# Altium project MercurialSDR.PrjPcb
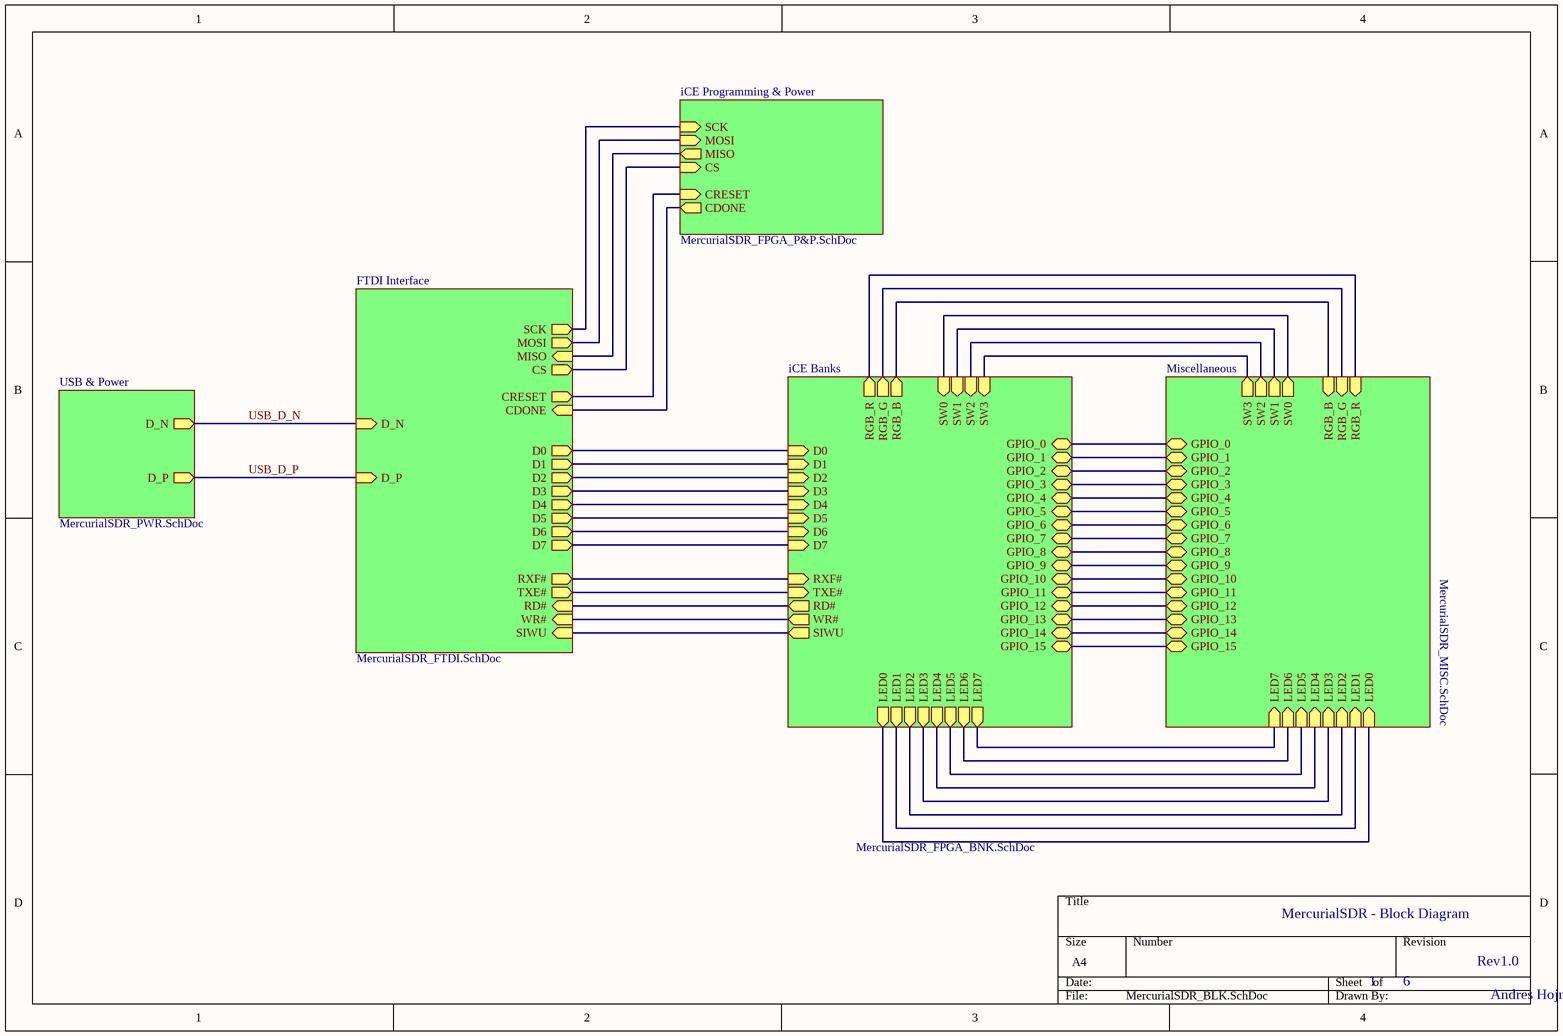
[diagram p0: MercurialSDR_BLK.SchDoc]
6 sheets, 142 parts. Net scope: hierarchical (ports join the sheet entries above them; power ports are global).
Board file: MercurialSDR.PcbDoc
Sheets:
  MercurialSDR_BLK.SchDoc
    Miscellaneous = MercurialSDR_MISC.SchDoc
    iCE Banks = MercurialSDR_FPGA_BNK.SchDoc
    iCE Programming & Power = MercurialSDR_FPGA_P&P.SchDoc
    FTDI Interface = MercurialSDR_FTDI.SchDoc
    USB & Power = MercurialSDR_PWR.SchDoc

## Sheet MercurialSDR_BLK.SchDoc: MercurialSDR - Block Diagram
size A4; Author: Andres Hojnadel; DrawnBy: Andres Hojnadel; Revision: Rev1.0; SheetNumber: 1; SheetTotal: 6; ProjectName: MercurialSDR

### Sub-sheets
FTDI Interface = MercurialSDR_FTDI.SchDoc: SCK (out), MOSI (out), MISO (in), CS (out), CDONE (in), CRESET (out), D0 (out), D1 (out), D2 (out), D3 (out), D4 (out), D5 (out), D6 (out), D7 (out), RXF# (out), TXE# (out), RD# (in), WR# (in), SIWU (in), D_N (in), D_P (in)
iCE Banks = MercurialSDR_FPGA_BNK.SchDoc: LED0 (out), LED1 (out), LED2 (out), LED3 (out), LED4 (out), LED5 (out), LED6 (out), LED7 (out), SW0 (in), SW1 (in), SW2 (in), SW3 (in), GPIO_0 (bidir), GPIO_1 (bidir), GPIO_2 (bidir), GPIO_3 (bidir), GPIO_4 (bidir), GPIO_5 (bidir), GPIO_6 (bidir), GPIO_7 (bidir), GPIO_8 (bidir), GPIO_9 (bidir), GPIO_10 (bidir), GPIO_11 (bidir), GPIO_12 (bidir), GPIO_13 (bidir), GPIO_14 (bidir), GPIO_15 (bidir), RGB_R (out), RGB_G (out), RGB_B (out), D3 (in), RXF# (in), D0 (in), TXE# (in), D7 (in), SIWU (out), D2 (in), D6 (in), D1 (in), D4 (in), WR# (out), RD# (out), D5 (in)
iCE Programming & Power = MercurialSDR_FPGA_P&P.SchDoc: CRESET (in), CDONE (out), CS (in), SCK (in), MOSI (in), MISO (out)
Miscellaneous = MercurialSDR_MISC.SchDoc: SW0 (out), SW1 (out), SW2 (out), SW3 (out), RGB_R (in), RGB_G (in), RGB_B (in), LED0 (in), LED1 (in), LED2 (in), LED3 (in), LED4 (in), LED5 (in), LED6 (in), LED7 (in), GPIO_0 (bidir), GPIO_1 (bidir), GPIO_2 (bidir), GPIO_3 (bidir), GPIO_4 (bidir), GPIO_5 (bidir), GPIO_6 (bidir), GPIO_7 (bidir), GPIO_8 (bidir), GPIO_9 (bidir), GPIO_10 (bidir), GPIO_11 (bidir), GPIO_12 (bidir), GPIO_13 (bidir), GPIO_14 (bidir), GPIO_15 (bidir)
USB & Power = MercurialSDR_PWR.SchDoc: D_N (out), D_P (out)

### Nets
CDONE_S: sheet iCE Programming & Power/CDONE, sheet FTDI Interface/CDONE
CS_S: sheet iCE Programming & Power/CS, sheet FTDI Interface/CS
MISO_S: sheet iCE Programming & Power/MISO, sheet FTDI Interface/MISO
MOSI_S: sheet iCE Programming & Power/MOSI, sheet FTDI Interface/MOSI
RESET_S: sheet iCE Programming & Power/CRESET, sheet FTDI Interface/CRESET
SCK_S: sheet iCE Programming & Power/SCK, sheet FTDI Interface/SCK
USB_D_N: sheet FTDI Interface/D_N, sheet USB & Power/D_N
USB_D_P: sheet FTDI Interface/D_P, sheet USB & Power/D_P
NetC31_2: sheet Miscellaneous/SW0, sheet iCE Banks/SW0
NetC32_2: sheet Miscellaneous/SW1, sheet iCE Banks/SW1
NetC33_2: sheet Miscellaneous/SW2, sheet iCE Banks/SW2
NetC34_2: sheet Miscellaneous/SW3, sheet iCE Banks/SW3
NetCN3_5: sheet Miscellaneous/GPIO_0, sheet iCE Banks/GPIO_0
NetCN3_6: sheet Miscellaneous/GPIO_1, sheet iCE Banks/GPIO_1
NetCN3_7: sheet Miscellaneous/GPIO_2, sheet iCE Banks/GPIO_2
NetCN3_8: sheet Miscellaneous/GPIO_3, sheet iCE Banks/GPIO_3
NetCN3_9: sheet Miscellaneous/GPIO_4, sheet iCE Banks/GPIO_4
NetCN3_10: sheet Miscellaneous/GPIO_5, sheet iCE Banks/GPIO_5
NetCN3_11: sheet Miscellaneous/GPIO_6, sheet iCE Banks/GPIO_6
NetCN3_12: sheet Miscellaneous/GPIO_7, sheet iCE Banks/GPIO_7
NetCN3_13: sheet Miscellaneous/GPIO_8, sheet iCE Banks/GPIO_8
NetCN3_14: sheet Miscellaneous/GPIO_9, sheet iCE Banks/GPIO_9
NetCN3_15: sheet Miscellaneous/GPIO_10, sheet iCE Banks/GPIO_10
NetCN3_16: sheet Miscellaneous/GPIO_11, sheet iCE Banks/GPIO_11
NetCN3_17: sheet Miscellaneous/GPIO_12, sheet iCE Banks/GPIO_12
NetCN3_18: sheet Miscellaneous/GPIO_13, sheet iCE Banks/GPIO_13
NetCN3_19: sheet Miscellaneous/GPIO_14, sheet iCE Banks/GPIO_14
NetCN3_20: sheet Miscellaneous/GPIO_15, sheet iCE Banks/GPIO_15
NetIC4_38: sheet iCE Banks/D0, sheet FTDI Interface/D0
NetIC4_39: sheet iCE Banks/D1, sheet FTDI Interface/D1
NetIC4_40: sheet iCE Banks/D2, sheet FTDI Interface/D2
NetIC4_41: sheet iCE Banks/D3, sheet FTDI Interface/D3
NetIC4_43: sheet iCE Banks/D4, sheet FTDI Interface/D4
NetIC4_44: sheet iCE Banks/D5, sheet FTDI Interface/D5
NetIC4_45: sheet iCE Banks/D6, sheet FTDI Interface/D6
NetIC4_46: sheet iCE Banks/D7, sheet FTDI Interface/D7
NetIC4_48: sheet iCE Banks/RXF#, sheet FTDI Interface/RXF#
NetIC4_52: sheet iCE Banks/TXE#, sheet FTDI Interface/TXE#
NetIC4_53: sheet iCE Banks/RD#, sheet FTDI Interface/RD#
NetIC4_54: sheet iCE Banks/WR#, sheet FTDI Interface/WR#
NetIC4_55: sheet iCE Banks/SIWU, sheet FTDI Interface/SIWU
NetR18_2: sheet Miscellaneous/LED0, sheet iCE Banks/LED0
NetR20_2: sheet Miscellaneous/LED1, sheet iCE Banks/LED1
NetR21_2: sheet Miscellaneous/RGB_R, sheet iCE Banks/RGB_R
NetR22_2: sheet Miscellaneous/RGB_G, sheet iCE Banks/RGB_G
NetR23_1: sheet Miscellaneous/RGB_B, sheet iCE Banks/RGB_B
NetR24_2: sheet Miscellaneous/LED2, sheet iCE Banks/LED2
NetR25_2: sheet Miscellaneous/LED3, sheet iCE Banks/LED3
NetR27_2: sheet Miscellaneous/LED4, sheet iCE Banks/LED4
NetR28_2: sheet Miscellaneous/LED5, sheet iCE Banks/LED5
NetR30_2: sheet Miscellaneous/LED6, sheet iCE Banks/LED6
NetR31_2: sheet Miscellaneous/LED7, sheet iCE Banks/LED7

## Sheet MercurialSDR_MISC.SchDoc: MercurialSDR - Miscellaneous
size A4; Author: Andres Hojnadel; DrawnBy: Andres Hojnadel; Revision: Rev1.1; SheetNumber: 6; SheetTotal: 6; ProjectName: MercurialSDR
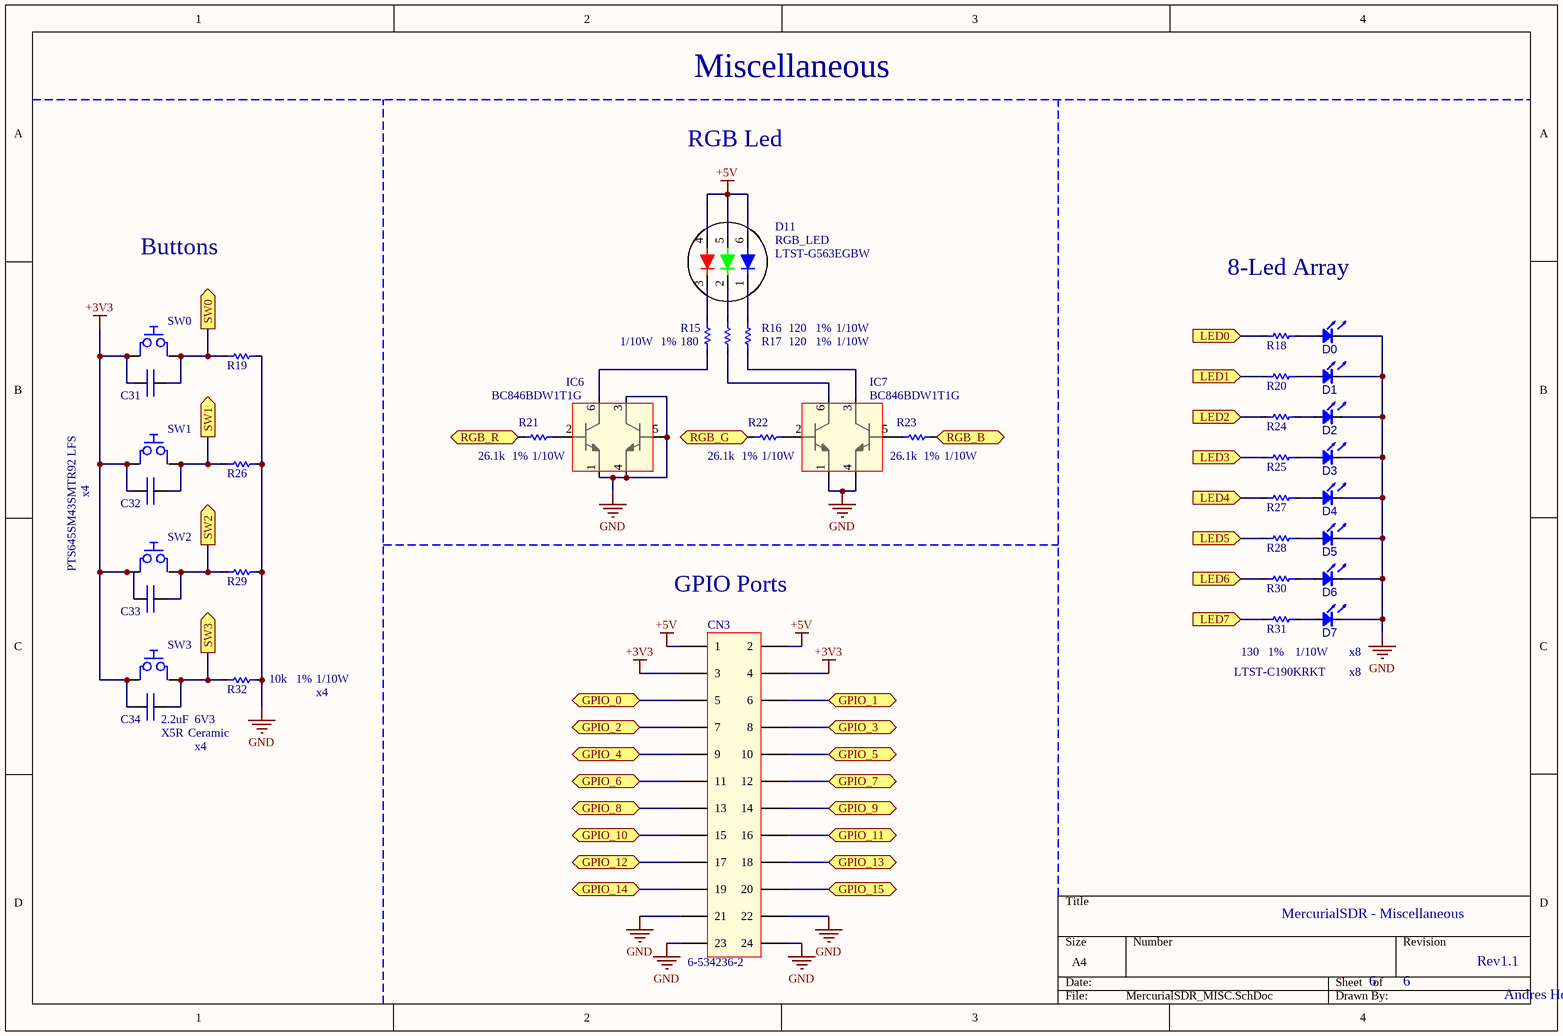
[diagram p1: MercurialSDR_MISC.SchDoc]

### Parts
C31  Capacitor  [CAP_0603]  (value not drawn)
C32  Capacitor  [CAP_0603]  (value not drawn)
C33  Capacitor  [CAP_0603]  (value not drawn)
C34  value 2.2uF  Temp Coef: X5R  VR: 6V3  Material: Ceramic  [CAP_0603]  (hidden comment: Capacitor)
CN3  Part Number: 6-534236-2  [CON_12x2]  (hidden comment: Connector)
D0  Led_small  [LED_0603]  (value not drawn)
D1  Led_small  [LED_0603]  (value not drawn)
D2  Led_small  [LED_0603]  (value not drawn)
D3  Led_small  [LED_0603]  (value not drawn)
D4  Led_small  [LED_0603]  (value not drawn)
D5  Led_small  [LED_0603]  (value not drawn)
D6  Led_small  [LED_0603]  (value not drawn)
D7  Part Number: LTST-C190KRKT  [LED_0603]  (hidden comment: Led_small)
D11  RGB_LED  Part Number: LTST-G563EGBW  [LED_RGB 5x5mm]
IC6  Part Number: BC846BDW1T1G  [TSSOP-6]  (hidden comment: BC846)
IC7  Part Number: BC846BDW1T1G  [TSSOP-6]  (hidden comment: BC846)
R15  value 180  Power: 1/10W  Tolerance: 1%  [RES_0603]  (hidden comment: Resistor SMD)
R16  value 120  Power: 1/10W  Tolerance: 1%  [RES_0603]  (hidden comment: Resistor SMD)
R17  value 120  Power: 1/10W  Tolerance: 1%  [RES_0603]  (hidden comment: Resistor SMD)
R18  Resistor SMD  [RES_0603]  (value not drawn)
R19  value 10k  Power: 1/10W  Tolerance: 1%  [RES_0603]  (hidden comment: Resistor SMD)
R20  Resistor SMD  [RES_0603]  (value not drawn)
R21  value 26.1k  Power: 1/10W  Tolerance: 1%  [RES_0603]  (hidden comment: Resistor SMD)
R22  value 26.1k  Power: 1/10W  Tolerance: 1%  [RES_0603]  (hidden comment: Resistor SMD)
R23  value 26.1k  Power: 1/10W  Tolerance: 1%  [RES_0603]  (hidden comment: Resistor SMD)
R24  Resistor SMD  [RES_0603]  (value not drawn)
R25  Resistor SMD  [RES_0603]  (value not drawn)
R26  Resistor SMD  [RES_0603]  (value not drawn)
R27  Resistor SMD  [RES_0603]  (value not drawn)
R28  Resistor SMD  [RES_0603]  (value not drawn)
R29  Resistor SMD  [RES_0603]  (value not drawn)
R30  Resistor SMD  [RES_0603]  (value not drawn)
R31  value 130  Power: 1/10W  Tolerance: 1%  [RES_0603]  (hidden comment: Resistor SMD)
R32  Resistor SMD  [RES_0603]  (value not drawn)
SW0  Pulsador  [SWITCH_6X6mm]  (value not drawn)
SW1  Pulsador  [SWITCH_6X6mm]  (value not drawn)
SW2  Pulsador  [SWITCH_6X6mm]  (value not drawn)
SW3  Part Number: PTS645SM43SMTR92 LFS  [SWITCH_6X6mm]  (hidden comment: Pulsador)

### Ports
GPIO_0 (bidir), GPIO_1 (bidir), GPIO_2 (bidir), GPIO_3 (bidir), GPIO_4 (bidir), GPIO_5 (bidir), GPIO_6 (bidir), GPIO_7 (bidir), GPIO_8 (bidir), GPIO_9 (bidir), GPIO_10 (bidir), GPIO_11 (bidir), GPIO_12 (bidir), GPIO_13 (bidir), GPIO_14 (bidir), GPIO_15 (bidir), LED0 (in), LED1 (in), LED2 (in), LED3 (in), LED4 (in), LED5 (in), LED6 (in), LED7 (in), RGB_B (in), RGB_G (in), RGB_R (in), SW0 (out), SW1 (out), SW2 (out), SW3 (out)

### Nets
+3V3: C31.1 C32.1 C33.1 C34.1 CN3.3 CN3.4 SW0.1 SW1.1 SW2.1 SW3.1
+5V: CN3.1 CN3.2 D11.4(RA) D11.5(GA) D11.6(BA)
GND: CN3.21 CN3.22 CN3.23 CN3.24 D0.2(K) D1.2(K) D2.2(K) D3.2(K) D4.2(K) D5.2(K) D6.2(K) D7.2(K) IC6.1(E_1) IC6.3(C_2) IC6.4(E_2) IC6.5(B_2) IC7.1(E_1) IC7.4(E_2) R19.1 R26.1 R29.1 R32.1
NetC31_2: C31.2 R19.2 SW0.4 ; port SW0
NetC32_2: C32.2 R26.2 SW1.4 ; port SW1
NetC33_2: C33.2 R29.2 SW2.4 ; port SW2
NetC34_2: C34.2 R32.2 SW3.4 ; port SW3
NetCN3_5: CN3.5 ; port GPIO_0
NetCN3_6: CN3.6 ; port GPIO_1
NetCN3_7: CN3.7 ; port GPIO_2
NetCN3_8: CN3.8 ; port GPIO_3
NetCN3_9: CN3.9 ; port GPIO_4
NetCN3_10: CN3.10 ; port GPIO_5
NetCN3_11: CN3.11 ; port GPIO_6
NetCN3_12: CN3.12 ; port GPIO_7
NetCN3_13: CN3.13 ; port GPIO_8
NetCN3_14: CN3.14 ; port GPIO_9
NetCN3_15: CN3.15 ; port GPIO_10
NetCN3_16: CN3.16 ; port GPIO_11
NetCN3_17: CN3.17 ; port GPIO_12
NetCN3_18: CN3.18 ; port GPIO_13
NetCN3_19: CN3.19 ; port GPIO_14
NetCN3_20: CN3.20 ; port GPIO_15
NetD0_1: D0.1(A) R18.1
NetD1_1: D1.1(A) R20.1
NetD2_1: D2.1(A) R24.1
NetD3_1: D3.1(A) R25.1
NetD4_1: D4.1(A) R27.1
NetD5_1: D5.1(A) R28.1
NetD6_1: D6.1(A) R30.1
NetD7_1: D7.1(A) R31.1
NetD11_1: D11.1(BK) R17.1
NetD11_2: D11.2(GK) R16.1
NetD11_3: D11.3(RK) R15.1
NetIC6_2: IC6.2(B_1) R21.1
NetIC6_6: IC6.6(C_1) R15.2
NetIC7_2: IC7.2(B_1) R22.1
NetIC7_3: IC7.3(C_2) R17.2
NetIC7_5: IC7.5(B_2) R23.2
NetIC7_6: IC7.6(C_1) R16.2
NetR18_2: R18.2 ; port LED0
NetR20_2: R20.2 ; port LED1
NetR21_2: R21.2 ; port RGB_R
NetR22_2: R22.2 ; port RGB_G
NetR23_1: R23.1 ; port RGB_B
NetR24_2: R24.2 ; port LED2
NetR25_2: R25.2 ; port LED3
NetR27_2: R27.2 ; port LED4
NetR28_2: R28.2 ; port LED5
NetR30_2: R30.2 ; port LED6
NetR31_2: R31.2 ; port LED7

Not connected (* = marked no-connect by the designer): SW0 2 3; SW1 2 3; SW2 2 3; SW3 2 3

### Notes on the sheet
- Miscellaneous
- RGB Led
- Buttons
- 8-Led Array
- x4
- (near CN3) GPIO Ports
- (near D7) x8
- (near R32) x4
- x8

### Library data of the parts
C31-C33 = Cap: Capacitor no polarizado; Part Number: CL10A225KQ8NNNC; Value: 2.2uF; Temp Coef: X5R; VR: 6V3; Material: Ceramic
C34 = Cap: Capacitor no polarizado; Part Number: CL10A225KQ8NNNC
CN3 = CN_12x2: Conector genérico 12x2
D0-D6 = Led_small: Part Number: LTST-C190KRKT; Color: Red
D7 = Led_small: Color: Red
D11 = LED_RGB: Led RGB
IC6 IC7 = BC846BDW_1: TBJ NPN Dual; Package: TSSOP-6
R15 = Res: Resistor; Part Number: CR0603-FX-1800ELF
R16 R17 = Res: Resistor; Part Number: CR0603-FX-1200ELF
R18 R20 R24 R25 R27 R28 R30 = Res: Resistor; Part Number: CR0603-FX-1300ELF; Value: 130; Power: 1/10W; Tolerance: 1%
R19 = Res: Resistor; Part Number: CR0603-FX-1002EAS
R21-R23 = Res: Resistor; Part Number: CR0603-FX-2612ELF
R26 R29 R32 = Res: Resistor; Part Number: CR0603-FX-1002EAS; Value: 10k; Power: 1/10W; Tolerance: 1%
R31 = Res: Resistor; Part Number: CR0603-FX-1300ELF
SW0-SW2 = Pulsador: Part Number: PTS645SM43SMTR92 LFS

## Sheet MercurialSDR_FPGA_BNK.SchDoc: MercurialSDR - iCE Banks
size A4; Author: Andres Hojnadel; DrawnBy: Andres Hojnadel; Revision: Rev2.0; SheetNumber: 5; SheetTotal: 6; ProjectName: MercurialSDR
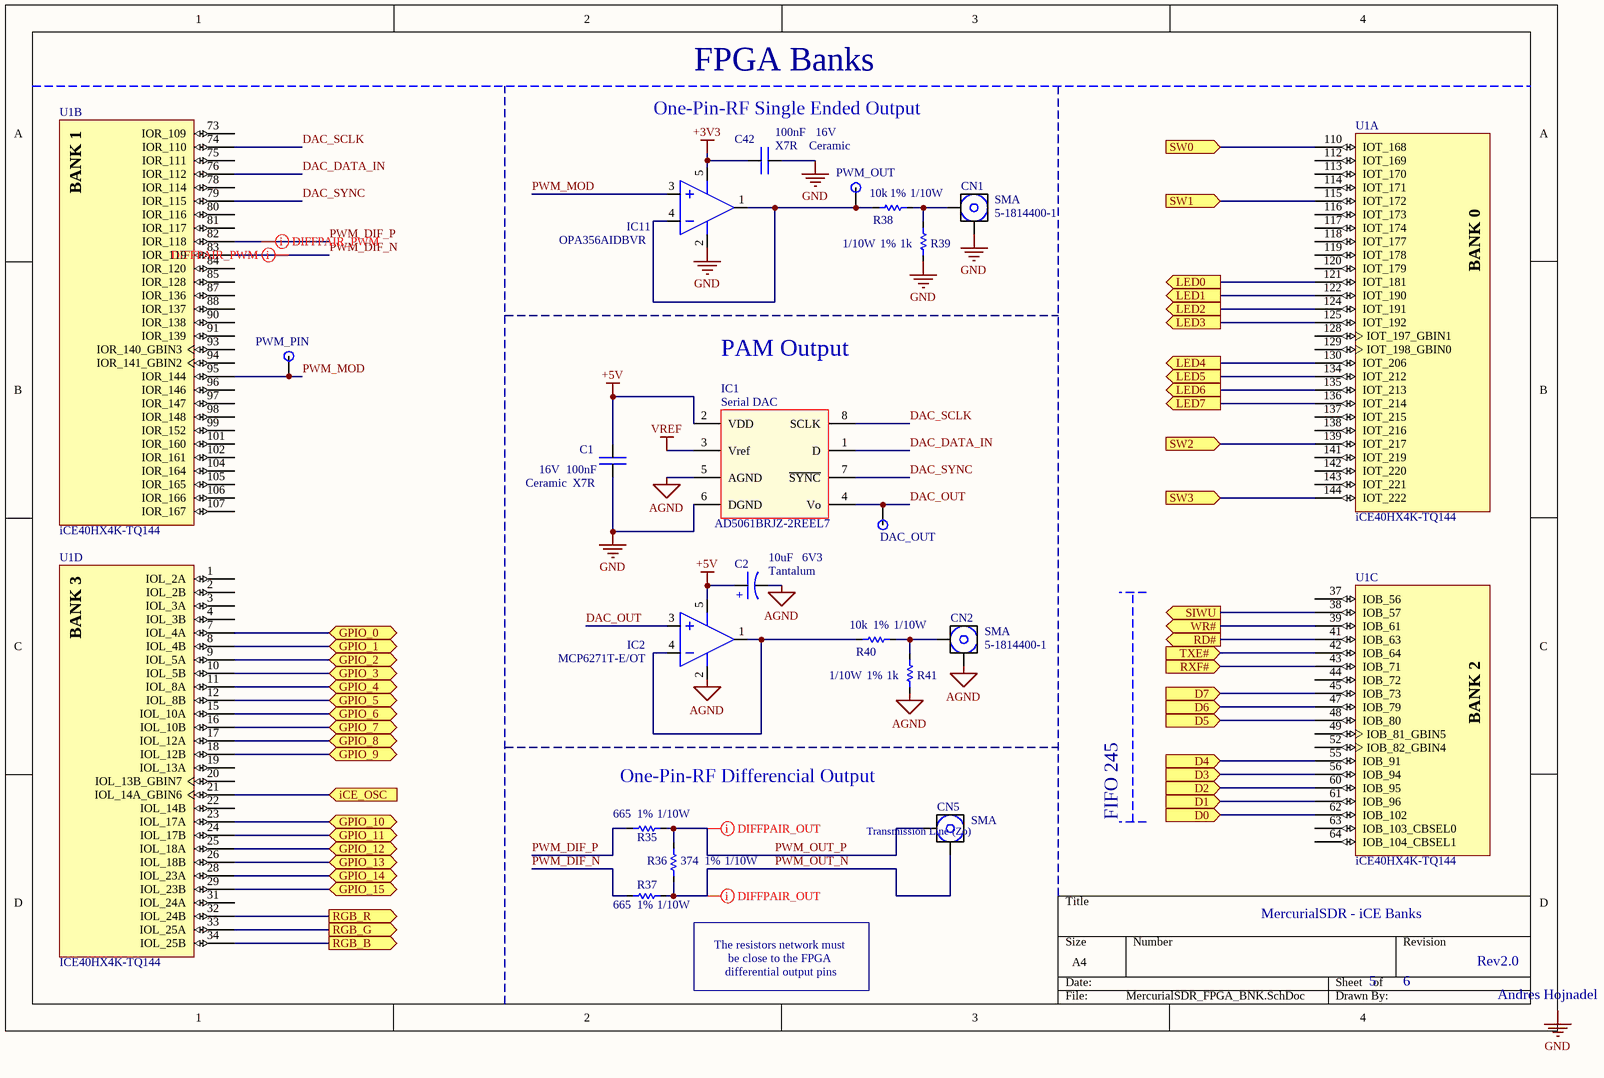
[diagram p2: MercurialSDR_FPGA_BNK.SchDoc]

### Parts
C1  value 100nF  Temp Coef: X7R  VR: 16V  Material: Ceramic  [CAP_0603]  (hidden comment: Capacitor)
C2  value 10uF  VR: 6V3  Material: Tantalum  [CAP_TANT_1206]  (hidden comment: Capacitor Polarizado)
C42  value 100nF  Temp Coef: X7R  VR: 16V  Material: Ceramic  [CAP_0603]  (hidden comment: Capacitor)
CN1  SMA  Part Number: 5-1814400-1  [SMA_Connector]
CN2  SMA  Part Number: 5-1814400-1  [SMA_Connector]
CN5  SMA  [SMA_Connector]
IC1  Serial DAC  Part Number: AD5061BRJZ-2REEL7  [SOT-23-8]
IC2  Part Number: MCP6271T-E/OT  [SOT-23-5]  (hidden comment: OPAMP)
IC11  Part Number: OPA356AIDBVR  [SOT-23-5_2]  (hidden comment: OPAMP)
R35  value 665  Power: 1/10W  Tolerance: 1%  [RES_0603]  (hidden comment: Resistor SMD)
R36  value 374  Power: 1/10W  Tolerance: 1%  [RES_0603]  (hidden comment: Resistor SMD)
R37  value 665  Power: 1/10W  Tolerance: 1%  [RES_0603]  (hidden comment: Resistor SMD)
R38  value 10k  Power: 1/10W  Tolerance: 1%  [RES_0603]  (hidden comment: Resistor SMD)
R39  value 1k  Power: 1/10W  Tolerance: 1%  [RES_0603]  (hidden comment: Resistor SMD)
R40  value 10k  Power: 1/10W  Tolerance: 1%  [RES_0603]  (hidden comment: Resistor SMD)
R41  value 1k  Power: 1/10W  Tolerance: 1%  [RES_0603]  (hidden comment: Resistor SMD)
TP1  TP Name: PWM_PIN  [TP_TOP]  (hidden comment: Test Point)
TP2  TP Name: DAC_OUT  [TP_TH]  (hidden comment: Test Point)
TP5  TP Name: PWM_OUT  [TP_TH]  (hidden comment: Test Point)
U1  iCE40HX4K-TQ144  [LATC-TQFP-144_L]  (parts A,B,C,D of 6)

### Ports
D0 (in), D1 (in), D2 (in), D3 (in), D4 (in), D5 (in), D6 (in), D7 (in), GPIO_0 (bidir), GPIO_1 (bidir), GPIO_2 (bidir), GPIO_3 (bidir), GPIO_4 (bidir), GPIO_5 (bidir), GPIO_6 (bidir), GPIO_7 (bidir), GPIO_8 (bidir), GPIO_9 (bidir), GPIO_10 (bidir), GPIO_11 (bidir), GPIO_12 (bidir), GPIO_13 (bidir), GPIO_14 (bidir), GPIO_15 (bidir), iCE_OSC (in), LED0 (out), LED1 (out), LED2 (out), LED3 (out), LED4 (out), LED5 (out), LED6 (out), LED7 (out), RD# (out), RGB_B (out), RGB_G (out), RGB_R (out), RXF# (in), SIWU (out), SW0 (in), SW1 (in), SW2 (in), SW3 (in), TXE# (in), WR# (out)

### Nets
+3V3: C42.2 IC11.5(VDD)
+5V: C1.1 C2.1 IC1.2(VDD) IC2.5(VDD)
AGND: C2.2 CN2.2(GND) IC1.5(AGND) IC2.2(Vss) R41.2
GND: C1.2 C42.1 CN1.2(GND) IC1.6(DGND) IC11.2(Vss) R39.2
VREF: IC1.3(Vref)
DAC_DATA_IN: IC1.1(D) U1.76(IOR_112)
DAC_OUT: IC1.4(Vo) IC2.3(V+) TP2.1(TP?)
DAC_SCLK: IC1.8(SCLK) U1.74(IOR_110)
DAC_SYNC: IC1.7(~{SYNC}) U1.79(IOR_115)
PWM_DIF_N: R37.2 U1.83(IOR_119)
PWM_DIF_P: R35.2 U1.82(IOR_118)
PWM_MOD: IC11.3(V+) TP1.1(TP?) U1.95(IOR_144)
PWM_OUT_N: CN5.2(GND) R36.2 R37.1
PWM_OUT_P: CN5.1(Vin) R35.1 R36.1
NetC31_2: U1.110(IOT_168) ; port SW0
NetC32_2: U1.115(IOT_172) ; port SW1
NetC33_2: U1.139(IOT_217) ; port SW2
NetC34_2: U1.144(IOT_222) ; port SW3
NetCN1_1: CN1.1(Vin) R38.2 R39.1
NetCN2_1: CN2.1(Vin) R40.2 R41.1
NetCN3_5: U1.7(IOL_4A) ; port GPIO_0
NetCN3_6: U1.8(IOL_4B) ; port GPIO_1
NetCN3_7: U1.9(IOL_5A) ; port GPIO_2
NetCN3_8: U1.10(IOL_5B) ; port GPIO_3
NetCN3_9: U1.11(IOL_8A) ; port GPIO_4
NetCN3_10: U1.12(IOL_8B) ; port GPIO_5
NetCN3_11: U1.15(IOL_10A) ; port GPIO_6
NetCN3_12: U1.16(IOL_10B) ; port GPIO_7
NetCN3_13: U1.17(IOL_12A) ; port GPIO_8
NetCN3_14: U1.18(IOL_12B) ; port GPIO_9
NetCN3_15: U1.23(IOL_17A) ; port GPIO_10
NetCN3_16: U1.24(IOL_17B) ; port GPIO_11
NetCN3_17: U1.25(IOL_18A) ; port GPIO_12
NetCN3_18: U1.26(IOL_18B) ; port GPIO_13
NetCN3_19: U1.28(IOL_23A) ; port GPIO_14
NetCN3_20: U1.29(IOL_23B) ; port GPIO_15
NetIC2_1: IC2.1(Vo) IC2.4(V-) R40.1
NetIC4_38: U1.62(IOB_102) ; port D0
NetIC4_39: U1.61(IOB_96) ; port D1
NetIC4_40: U1.60(IOB_95) ; port D2
NetIC4_41: U1.56(IOB_94) ; port D3
NetIC4_43: U1.55(IOB_91) ; port D4
NetIC4_44: U1.48(IOB_80) ; port D5
NetIC4_45: U1.47(IOB_79) ; port D6
NetIC4_46: U1.45(IOB_73) ; port D7
NetIC4_48: U1.43(IOB_71) ; port RXF#
NetIC4_52: U1.42(IOB_64) ; port TXE#
NetIC4_53: U1.41(IOB_63) ; port RD#
NetIC4_54: U1.39(IOB_61) ; port WR#
NetIC4_55: U1.38(IOB_57) ; port SIWU
NetIC11_1: IC11.1(Vo) IC11.4(V-) R38.1 TP5.1(TP?)
NetR18_2: U1.121(IOT_181) ; port LED0
NetR20_2: U1.122(IOT_190) ; port LED1
NetR21_2: U1.32(IOL_24B) ; port RGB_R
NetR22_2: U1.33(IOL_25A) ; port RGB_G
NetR23_1: U1.34(IOL_25B) ; port RGB_B
NetR24_2: U1.124(IOT_191) ; port LED2
NetR25_2: U1.125(IOT_192) ; port LED3
NetR27_2: U1.130(IOT_206) ; port LED4
NetR28_2: U1.134(IOT_212) ; port LED5
NetR30_2: U1.135(IOT_213) ; port LED6
NetR31_2: U1.136(IOT_214) ; port LED7
NetU1_21: U1.21(IOL_14A_GBIN6) ; port iCE_OSC

Not connected (* = marked no-connect by the designer): U1 1(IOL_2A) 2(IOL_2B) 3(IOL_3A) 4(IOL_3B) 19(IOL_13A) 20(IOL_13B_GBIN7) 22(IOL_14B) 31(IOL_24A) 37(IOB_56) 44(IOB_72) 49(IOB_81_GBIN5) 52(IOB_82_GBIN4) 63(IOB_103_CBSEL0) 64(IOB_104_CBSEL1) 73(IOR_109) 75(IOR_111) 78(IOR_114) 80(IOR_116) 81(IOR_117) 84(IOR_120) 85(IOR_128) 87(IOR_136) 88(IOR_137) 90(IOR_138) 91(IOR_139) 93(IOR_140_GBIN3) 94(IOR_141_GBIN2) 96(IOR_146) 97(IOR_147) 98(IOR_148) 99(IOR_152) 101(IOR_160) 102(IOR_161) 104(IOR_164) 105(IOR_165) 106(IOR_166) 107(IOR_167) 112(IOT_169) 113(IOT_170) 114(IOT_171) 116(IOT_173) 117(IOT_174) 118(IOT_177) 119(IOT_178) 120(IOT_179) 128(IOT_197_GBIN1) 129(IOT_198_GBIN0) 137(IOT_215) 138(IOT_216) 141(IOT_219) 142(IOT_220) 143(IOT_221)

### Layout directives
differential pair: PWM_DIF_N, PWM_DIF_P, PWM_OUT_N, PWM_OUT_P

### Notes on the sheet
- One-Pin-RF Single Ended Output
- FPGA Banks
- PAM Output
- One-Pin-RF Differencial Output
- FIFO 245
- Transmission Line (Zo)
- The resistors network must
  be close to the FPGA
  differential output pins
- Labels drawn without touching a wire or pin: GND
- (in symbol Cap Pol) +
- (in symbol ICE40HX4K-TQ144, part A) BANK 0
- (in symbol ICE40HX4K-TQ144, part B) BANK 1
- (in symbol ICE40HX4K-TQ144, part C) BANK 2
- (in symbol ICE40HX4K-TQ144, part D) BANK 3

### Library data of the parts
C1 C42 = Cap: Capacitor no polarizado; Part Number: CL10B104KO8NNNC
C2 = Cap Pol: Part Number: TAJA106K006RNJ; Temp Coef: *
CN1 CN2 = SMA: Conector SMA
CN5 = SMA: Conector SMA; Part Number: 5-1814400-1
IC1 = AD5061: DAC SPI; Bits: 16; Settling Time: 4us; Communication: SPI
IC2 IC11 = OPAMP: Operational Amplifier
R35 R37 = Res: Resistor; Part Number: RC0603FR-07665RL
R36 = Res: Resistor; Part Number: RC0603FR-07374RL
R38 R40 = Res: Resistor; Part Number: CR0603-FX-1002EAS
R39 R41 = Res: Resistor; Part Number: CR0603-FX-1001ELF
U1 = ICE40HX4K-TQ144: iCE40 HX4K Series FPGA Family, 3520 Logic Cells, 1.2 V Core, 80 K Embedded RAM Bits, 144-pin TQFP, Pb-Free, Tray; Manufacturer: Lattice Semiconductor; Phase-Locked Loops: 2; Supply Voltage: 1.2V; Logic Cells: 3520; Embedded RAM Bits: 80K; ComponentLink1Description: Manufacturer URL; ComponentLink2Description: Datasheet; DatasheetVersion: Rev. 02.9; Mounting Technology: Surface Mount; ComponentLink3URL: http://www.latticesemi.com/lit/docs/package/pkg.pdf; ComponentLink3Description: Package Specification; ComponentLink1URL: http://www.latticesemi.com/en; ComponentLink2URL: http://www.latticesemi.com/~/media/Documents/DataSheets/iCE/iCE40LPHXFamilyDataSheet.pdf; PackageReference: TQFP-144; Packing: Tray; PartNumber: ICE40HX4K-TQ144; PackageDescription: 144-Pin Thin Quad Flat Package, Body 20 x 20 mm, Pitch 0.5 mm; PackageVersion: Rev. 03.9, 02/2013; RoHS: TRUE

## Sheet MercurialSDR_FPGA_P&P.SchDoc: MercurialSDR - iCE Power & Program.
size A4; Author: Andres Hojnadel; DrawnBy: Andres Hojnadel; Revision: Rev2.0; SheetNumber: 4; SheetTotal: 6; ProjectName: MercurialSDR
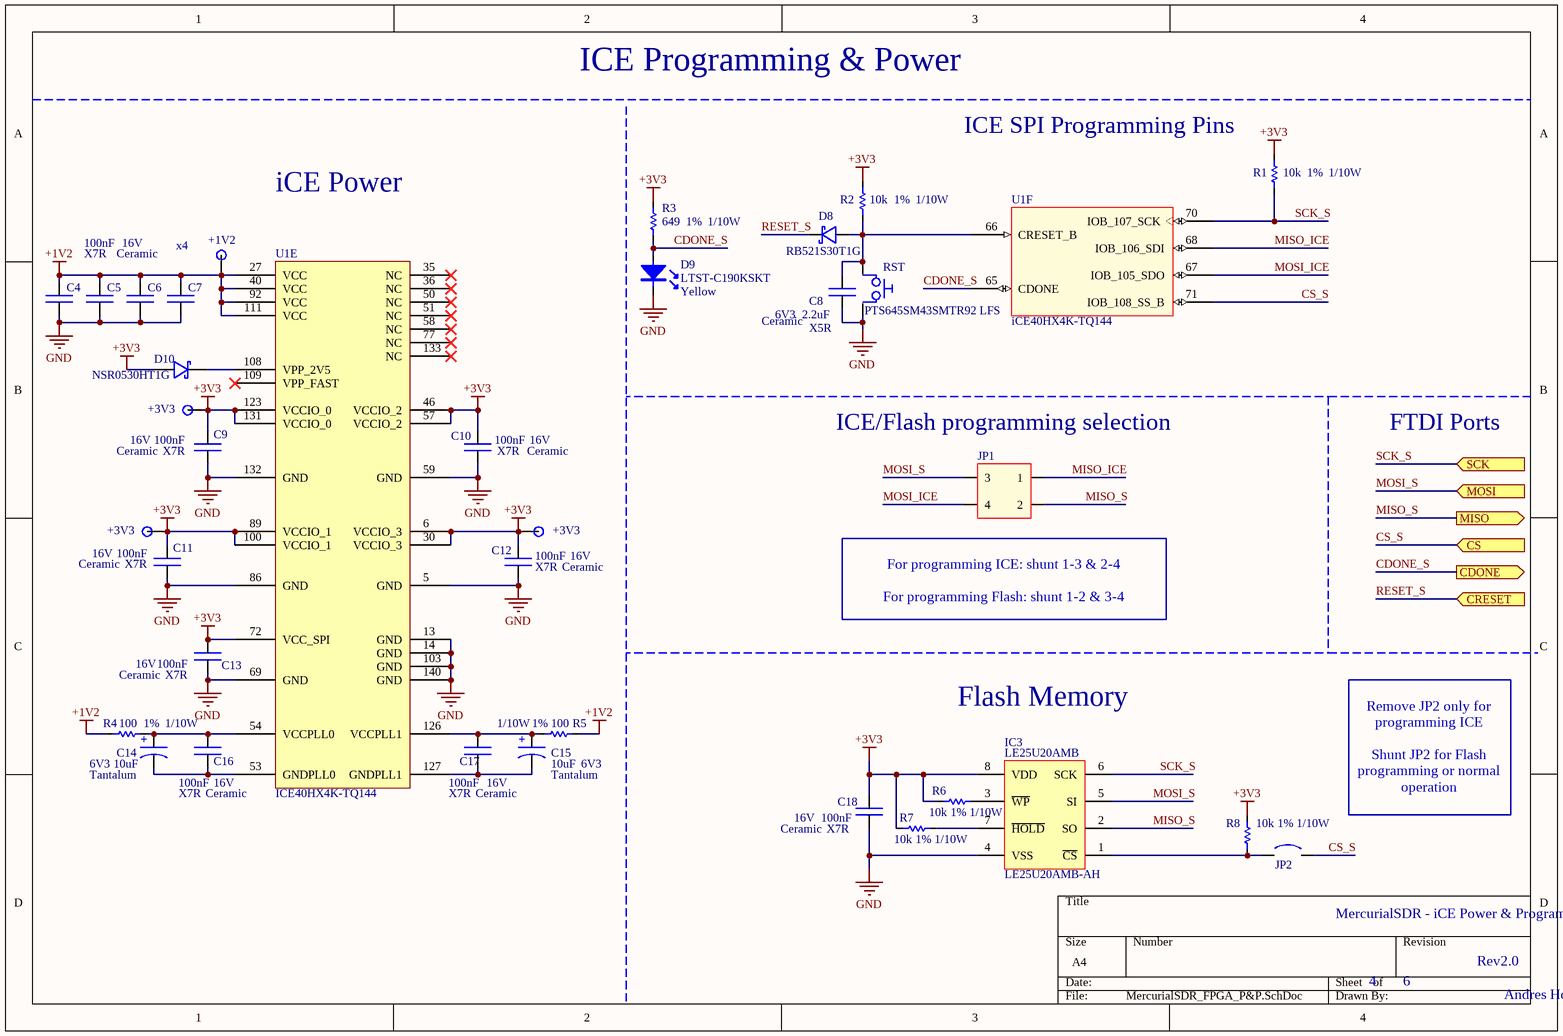
[diagram p3: MercurialSDR_FPGA_P&P.SchDoc]

### Parts
C4  Capacitor  [CAP_0603]  (value not drawn)
C5  Capacitor  [CAP_0603]  (value not drawn)
C6  Capacitor  [CAP_0603]  (value not drawn)
C7  value 100nF  Temp Coef: X7R  VR: 16V  Material: Ceramic  [CAP_0603]  (hidden comment: Capacitor)
C8  value 2.2uF  Temp Coef: X5R  VR: 6V3  Material: Ceramic  [CAP_0603]  (hidden comment: Capacitor)
C9  value 100nF  Temp Coef: X7R  VR: 16V  Material: Ceramic  [CAP_0603]  (hidden comment: Capacitor)
C10  value 100nF  Temp Coef: X7R  VR: 16V  Material: Ceramic  [CAP_0603]  (hidden comment: Capacitor)
C11  value 100nF  Temp Coef: X7R  VR: 16V  Material: Ceramic  [CAP_0603]  (hidden comment: Capacitor)
C12  value 100nF  Temp Coef: X7R  VR: 16V  Material: Ceramic  [CAP_0603]  (hidden comment: Capacitor)
C13  value 100nF  Temp Coef: X7R  VR: 16V  Material: Ceramic  [CAP_0603]  (hidden comment: Capacitor)
C14  value 10uF  VR: 6V3  Material: Tantalum  [CAP_TANT_1206]  (hidden comment: Capacitor Polarizado)
C15  value 10uF  VR: 6V3  Material: Tantalum  [CAP_TANT_1206]  (hidden comment: Capacitor Polarizado)
C16  value 100nF  Temp Coef: X7R  VR: 16V  Material: Ceramic  [CAP_0603]  (hidden comment: Capacitor)
C17  value 100nF  Temp Coef: X7R  VR: 16V  Material: Ceramic  [CAP_0603]  (hidden comment: Capacitor)
C18  value 100nF  Temp Coef: X7R  VR: 16V  Material: Ceramic  [CAP_0603]  (hidden comment: Capacitor)
D8  Part Number: RB521S30T1G  [SOD-523]  (hidden comment: Schottky Diode)
D9  Color: Yellow  Part Number: LTST-C190KSKT  [LED_0603]  (hidden comment: Led)
D10  Part Number: NSR0530HT1G  [SOD-323]  (hidden comment: Schottky Diode)
IC3  LE25U20AMB  Part Number: LE25U20AMB-AH  [SOIC-8]
JP1  Jumper  [Jumper 2x2]  (value not drawn)
JP2  Jumper  [Jumper 2x1]  (value not drawn)
R1  value 10k  Power: 1/10W  Tolerance: 1%  [RES_0603]  (hidden comment: Resistor SMD)
R2  value 10k  Power: 1/10W  Tolerance: 1%  [RES_0603]  (hidden comment: Resistor SMD)
R3  value 649  Power: 1/10W  Tolerance: 1%  [RES_0603]  (hidden comment: Resistor SMD)
R4  value 100  Power: 1/10W  Tolerance: 1%  [RES_0603]  (hidden comment: Resistor SMD)
R5  value 100  Power: 1/10W  Tolerance: 1%  [RES_0603]  (hidden comment: Resistor SMD)
R6  value 10k  Power: 1/10W  Tolerance: 1%  [RES_0603]  (hidden comment: Resistor SMD)
R7  value 10k  Power: 1/10W  Tolerance: 1%  [RES_0603]  (hidden comment: Resistor SMD)
R8  value 10k  Power: 1/10W  Tolerance: 1%  [RES_0603]  (hidden comment: Resistor SMD)
SW4  Part Number: PTS645SM43SMTR92 LFS  Serigrafia: RST  [SWITCH_6X6mm]  (hidden comment: Pulsador)
TP3  TP Name: +1V2  [TP_TOP]  (hidden comment: Test Point)
TP4  TP Name: +3V3  [TP_TOP]  (hidden comment: Test Point)
TP6  TP Name: +3V3  [TP_TOP]  (hidden comment: Test Point)
TP7  TP Name: +3V3  [TP_TOP]  (hidden comment: Test Point)
U1  ICE40HX4K-TQ144  [LATC-TQFP-144_L]  (parts E,F of 6)

### Ports
CDONE (out), CRESET (in), CS (in), MISO (out), MOSI (in), SCK (in)

### Nets
+1V2: C4.1 C5.1 C6.1 C7.1 R4.2 R5.1 TP3.1(TP?) U1.27(VCC) U1.40(VCC) U1.92(VCC) U1.111(VCC)
+3V3: C9.2 C10.2 C11.2 C12.2 C13.2 C18.2 D10.1(A) IC3.8(VDD) R1.1 R2.1 R3.1 R6.1 R7.1 R8.2 TP4.1(TP?) TP6.1(TP?) TP7.1(TP?) U1.6(VCCIO_3) U1.30(VCCIO_3) U1.46(VCCIO_2) U1.57(VCCIO_2) U1.72(VCC_SPI) U1.89(VCCIO_1) U1.100(VCCIO_1) U1.123(VCCIO_0) U1.131(VCCIO_0)
GND: C4.2 C5.2 C6.2 C7.2 C8.2 C9.1 C10.1 C11.1 C12.1 C13.1 C18.1 D9.2(K) IC3.4(VSS) SW4.4 U1.5(GND) U1.13(GND) U1.14(GND) U1.59(GND) U1.69(GND) U1.86(GND) U1.103(GND) U1.132(GND) U1.140(GND)
CDONE_S: D9.1(A) R3.2 U1.65(CDONE) ; port CDONE
CS_S: JP2.2 U1.71(IOB_108_SS_B) ; port CS
MISO_ICE: JP1.1 U1.68(IOB_106_SDI)
MISO_S: IC3.2(SO) JP1.2 ; port MISO
MOSI_ICE: JP1.4 U1.67(IOB_105_SDO)
MOSI_S: IC3.5(SI) JP1.3 ; port MOSI
RESET_S: D8.2(K) ; port CRESET
SCK_S: IC3.6(SCK) R1.2 U1.70(IOB_107_SCK) ; port SCK
NetC8_1: C8.1 D8.1(A) R2.2 SW4.1 U1.66(CRESET_B)
NetC14_1: C14.1 C16.1 R4.1 U1.54(VCCPLL0)
NetC14_2: C14.2 C16.2 U1.53(GNDPLL0)
NetC15_1: C15.1 C17.1 R5.2 U1.126(VCCPLL1)
NetC15_2: C15.2 C17.2 U1.127(GNDPLL1)
NetD10_2: D10.2(K) U1.108(VPP_2V5)
NetIC3_1: IC3.1(~{CS}) JP2.1 R8.1
NetIC3_3: IC3.3(~{WP}) R6.2
NetIC3_7: IC3.7(~{HOLD}) R7.2

Not connected (* = marked no-connect by the designer): SW4 2 3; U1 35(NC)* 36(NC)* 50(NC)* 51(NC)* 58(NC)* 77(NC)* 109(VPP_FAST)* 133(NC)*

### Notes on the sheet
- ICE Programming & Power
- (near R1) ICE SPI Programming Pins
- x4
- iCE Power
- (near JP1) ICE/Flash programming selection
- FTDI Ports
- (near JP1) For programming ICE: shunt 1-3 & 2-4
  For programming Flash: shunt 1-2 & 3-4
- Flash Memory
- Remove JP2 only for programming ICE
  Shunt JP2 for Flash programming or normal operation
- (in symbol Cap Pol) +

### Library data of the parts
C4-C6 = Cap: Capacitor no polarizado; Part Number: CL10B104KO8NNNC; Value: 100nF; Temp Coef: X7R; VR: 16V; Material: Ceramic
C7 C9-C13 C16-C18 = Cap: as C1 on sheet MercurialSDR_FPGA_BNK
C8 = Cap: as C34 on sheet MercurialSDR_MISC
C14 C15 = Cap Pol: Part Number: TAJA106K006RNJ; Temp Coef: *
D8 D10 = Diodo_Schottky: Diodo Schottkey; In: *; VR: *
IC3 = LE25U20AMB: Flash Memmory SPI (256Kx8)
JP1 = Jumper 2x2
R1 R2 R6-R8 = Res: Resistor; Part Number: CR0603-FX-1002EAS
R3 = Res: Resistor; Part Number: RC0603FR-07649RL
R4 R5 = Res: Resistor; Part Number: CR0603-FX-1000ELF
U1 = ICE40HX4K-TQ144: as U1 on sheet MercurialSDR_FPGA_BNK; ComponentLink1Description: Manufacturer URL; ComponentLink2Description: Datasheet; DatasheetVersion: Rev. 02.9; Mounting Technology: Surface Mount; ComponentLink3URL: http://www.latticesemi.com/lit/docs/package/pkg.pdf; ComponentLink3Description: Package Specification; ComponentLink1URL: http://www.latticesemi.com/en; ComponentLink2URL: http://www.latticesemi.com/~/media/Documents/DataSheets/iCE/iCE40LPHXFamilyDataSheet.pdf; PackageReference: TQFP-144; Packing: Tray; Part Number: ICE40HX4K-TQ144; PackageDescription: 144-Pin Thin Quad Flat Package, Body 20 x 20 mm, Pitch 0.5 mm; PackageVersion: Rev. 03.9, 02/2013; RoHS: TRUE
JP2 = Jumper: Part Number: *

## Sheet MercurialSDR_FTDI.SchDoc: MercurialSDR - FTDI Interface
size A4; Author: Andres Hojnadel; DrawnBy: Andres Hojnadel; Revision: Rev1.0; SheetNumber: 3; SheetTotal: 6; ProjectName: MercurialSDR
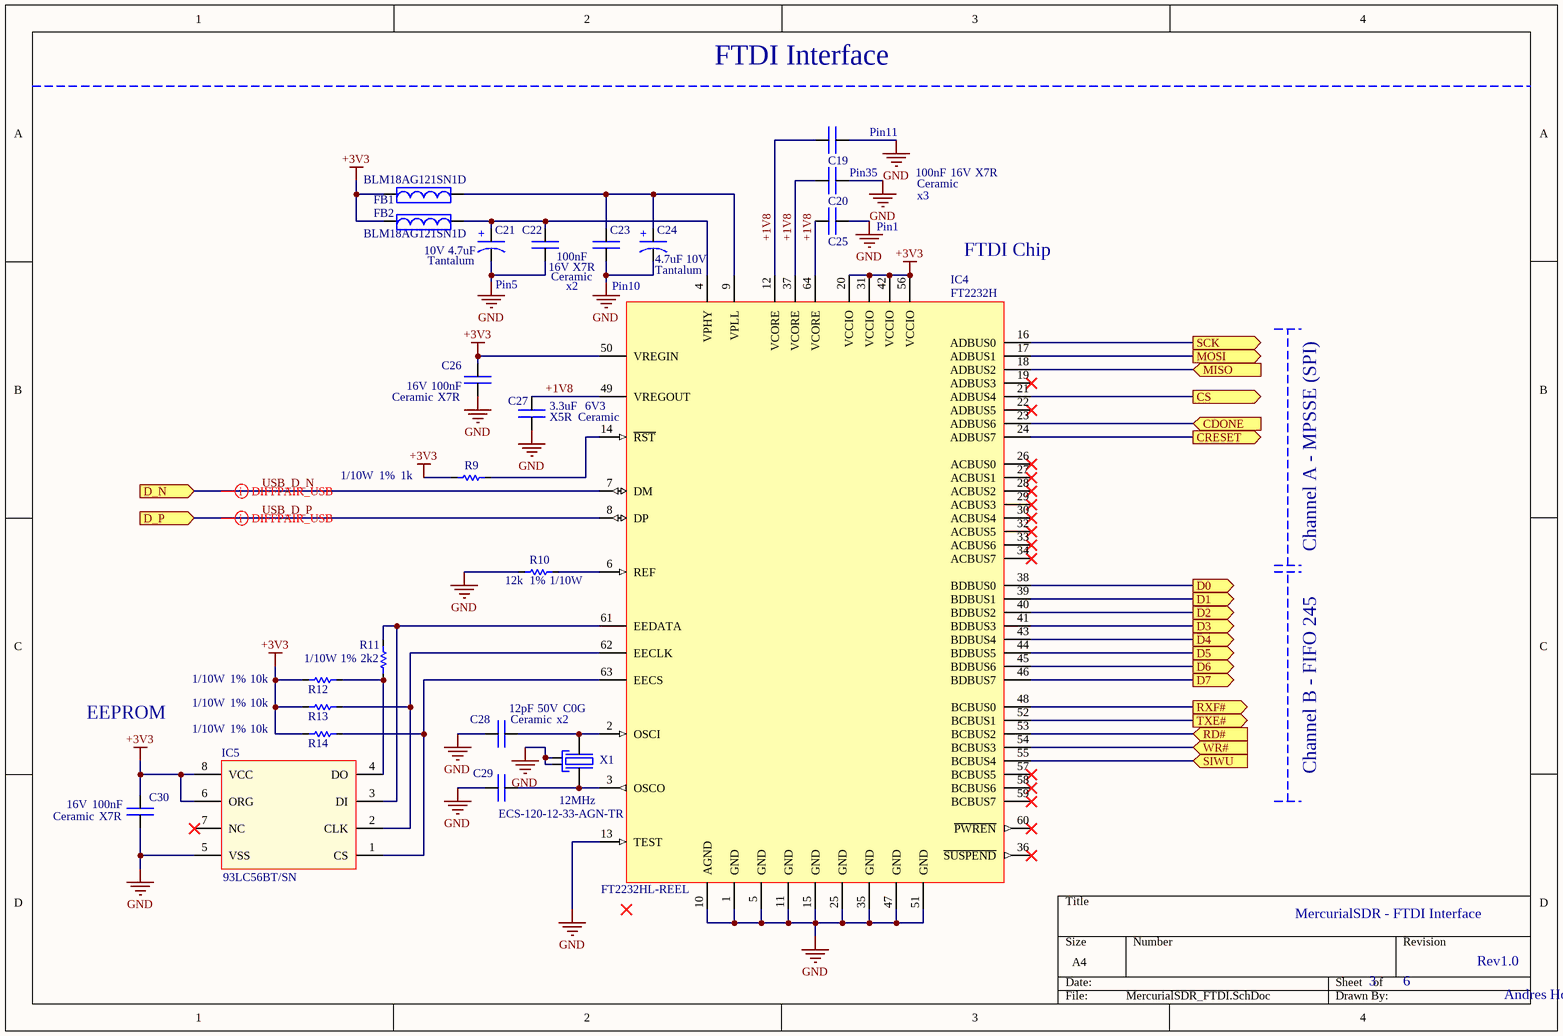
[diagram p4: MercurialSDR_FTDI.SchDoc]

### Parts
C19  value 100nF  Temp Coef: X7R  VR: 16V  Material: Ceramic  [CAP_0603]  (hidden comment: Capacitor)
C20  Capacitor  [CAP_0603]  (value not drawn)
C21  value 4.7uF  VR: 10V  Material: Tantalum  [CAP_TANT_1206]  (hidden comment: Capacitor Polarizado)
C22  value 100nF  Temp Coef: X7R  VR: 16V  Material: Ceramic  [CAP_0603]  (hidden comment: Capacitor)
C23  Capacitor  [CAP_0603]  (value not drawn)
C24  value 4.7uF  VR: 10V  Material: Tantalum  [CAP_TANT_1206]  (hidden comment: Capacitor Polarizado)
C25  Capacitor  [CAP_0603]  (value not drawn)
C26  value 100nF  Temp Coef: X7R  VR: 16V  Material: Ceramic  [CAP_0603]  (hidden comment: Capacitor)
C27  value 3.3uF  Temp Coef: X5R  VR: 6V3  Material: Ceramic  [CAP_0603]  (hidden comment: Capacitor)
C28  value 12pF  Temp Coef: C0G  VR: 50V  Material: Ceramic  [CAP_0603]  (hidden comment: Capacitor)
C29  Capacitor  [CAP_0603]  (value not drawn)
C30  value 100nF  Temp Coef: X7R  VR: 16V  Material: Ceramic  [CAP_0603]  (hidden comment: Capacitor)
FB1  Part Number: BLM18AG121SN1D  [FERRITE_BEAD_0603]  (hidden comment: Ferrite Bead)
FB2  Part Number: BLM18AG121SN1D  [FERRITE_BEAD_0603]  (hidden comment: Ferrite Bead)
IC4  FT2232H  Part Number: FT2232HL-REEL  [LQFP_64]
IC5  93LC56BT  [SOIC-8]  (value not drawn)
R9  value 1k  Power: 1/10W  Tolerance: 1%  [RES_0603]  (hidden comment: Resistor SMD)
R10  value 12k  Power: 1/10W  Tolerance: 1%  [RES_0603]  (hidden comment: Resistor SMD)
R11  value 2k2  Power: 1/10W  Tolerance: 1%  [RES_0603]  (hidden comment: Resistor SMD)
R12  value 10k  Power: 1/10W  Tolerance: 1%  [RES_0603]  (hidden comment: Resistor SMD)
R13  value 10k  Power: 1/10W  Tolerance: 1%  [RES_0603]  (hidden comment: Resistor SMD)
R14  value 10k  Power: 1/10W  Tolerance: 1%  [RES_0603]  (hidden comment: Resistor SMD)
X1  Part Number: ECS-120-12-33-AGN-TR  Frquency: 12MHz  [XTAL_3.2x2.5]  (hidden comment: XTAL_4term)

### Ports
CDONE (in), CRESET (out), CS (out), D0 (out), D1 (out), D2 (out), D3 (out), D4 (out), D5 (out), D6 (out), D7 (out), D_N (in), D_P (in), MISO (in), MOSI (out), RD# (in), RXF# (out), SCK (out), SIWU (in), TXE# (out), WR# (in)

### Nets
+3V3: C26.1 C30.1 FB1.1 FB2.1 IC4.20(VCCIO) IC4.31(VCCIO) IC4.42(VCCIO) IC4.50(VREGIN) IC4.56(VCCIO) IC5.6(ORG) IC5.8(VCC) R9.2 R12.2 R13.1 R14.1
GND: C19.2 C20.2 C21.2 C22.2 C23.2 C24.2 C25.2 C26.2 C27.2 C28.2 C29.1 C30.2 IC4.1(GND) IC4.5(GND) IC4.10(AGND) IC4.11(GND) IC4.13(TEST) IC4.15(GND) IC4.25(GND) IC4.35(GND) IC4.47(GND) IC4.51(GND) IC5.5(VSS) R10.2 X1.2 X1.4
+1V8: C19.1 C20.1 C25.1 C27.1 IC4.12(VCORE) IC4.37(VCORE) IC4.49(VREGOUT) IC4.64(VCORE)
CDONE_S: IC4.23(ADBUS6) ; port CDONE
CS_S: IC4.21(ADBUS4) ; port CS
MISO_S: IC4.18(ADBUS2) ; port MISO
MOSI_S: IC4.17(ADBUS1) ; port MOSI
RESET_S: IC4.24(ADBUS7) ; port CRESET
SCK_S: IC4.16(ADBUS0) ; port SCK
USB_D_N: IC4.7(DM) ; port D_N
USB_D_P: IC4.8(DP) ; port D_P
NetC21_1: C21.1 C22.1 FB2.2 IC4.4(VPHY)
NetC23_1: C23.1 C24.1 FB1.2 IC4.9(VPLL)
NetC28_1: C28.1 IC4.2(OSCI) X1.1
NetC29_2: C29.2 IC4.3(OSCO) X1.3
NetIC4_6: IC4.6(REF) R10.1
NetIC4_14: IC4.14(~{RST}) R9.1
NetIC4_38: IC4.38(BDBUS0) ; port D0
NetIC4_39: IC4.39(BDBUS1) ; port D1
NetIC4_40: IC4.40(BDBUS2) ; port D2
NetIC4_41: IC4.41(BDBUS3) ; port D3
NetIC4_43: IC4.43(BDBUS4) ; port D4
NetIC4_44: IC4.44(BDBUS5) ; port D5
NetIC4_45: IC4.45(BDBUS6) ; port D6
NetIC4_46: IC4.46(BDBUS7) ; port D7
NetIC4_48: IC4.48(BCBUS0) ; port RXF#
NetIC4_52: IC4.52(BCBUS1) ; port TXE#
NetIC4_53: IC4.53(BCBUS2) ; port RD#
NetIC4_54: IC4.54(BCBUS3) ; port WR#
NetIC4_55: IC4.55(BCBUS4) ; port SIWU
NetIC4_61: IC4.61(EEDATA) IC5.3(DI) R11.2
NetIC4_62: IC4.62(EECLK) IC5.2(CLK) R13.2
NetIC4_63: IC4.63(EECS) IC5.1(CS) R14.2
NetIC5_4: IC5.4(DO) R11.1 R12.1

Not connected (* = marked no-connect by the designer): IC4 19(ADBUS3)* 22(ADBUS5)* 26(ACBUS0)* 27(ACBUS1)* 28(ACBUS2)* 29(ACBUS3)* 30(ACBUS4)* 32(ACBUS5)* 33(ACBUS6)* 34(ACBUS7)* 36(~{SUSPEND})* 57(BCBUS5)* 58(BCBUS6)* 59(BCBUS7)* 60(~{PWREN})*; IC5 7(NC)*

### Layout directives
differential pair: USB_D_N, USB_D_P

### Notes on the sheet
- FTDI Interface
- (near C20) Pin35
- Pin11
- Pin1
- x3
- Pin5
- x2
- (near IC4) Pin10
- (near IC4) FTDI Chip
- Channel A - MPSSE (SPI)
- EEPROM
- (near X1) x2
- Channel B - FIFO 245
- (in symbol Cap Pol) +

### Library data of the parts
C19 C22 C26 C30 = Cap: as C1 on sheet MercurialSDR_FPGA_BNK
C20 C23 C25 = Cap: as C4 on sheet MercurialSDR_FPGA_P&P
C21 C24 = Cap Pol: Part Number: TAJA475K010RNJ; Temp Coef: *
C27 = Cap: Capacitor no polarizado; Part Number: C0603C335M9PACTU
C28 = Cap: Capacitor no polarizado; Part Number: CL10C120JB8NNNC
C29 = Cap: Capacitor no polarizado; Part Number: CL10C120JB8NNNC; Value: 12pF; Temp Coef: C0G; VR: 50V; Material: Ceramic
IC4 = FT2232H: USB bridge
IC5 = 93LC56BT/SN: EEPROM SPI 2kb (128x16); Part Number: 93LC56BT/SN
R9 = Res: Resistor; Part Number: CR0603-FX-1001ELF
R10 = Res: Resistor; Part Number: CR0603-FX-1202ELF
R11 = Res: Resistor; Part Number: CR0603-FX-2201ELF
R12-R14 = Res: Resistor; Part Number: CR0603-FX-1002EAS
X1 = XTAL_4term: Oscilador a Cristal

## Sheet MercurialSDR_PWR.SchDoc: MercurialSDR - Power Stage
size A4; Author: Andres Hojnadel; DrawnBy: Andres Hojnadel; Revision: Rev2.0; SheetNumber: 2; SheetTotal: 6
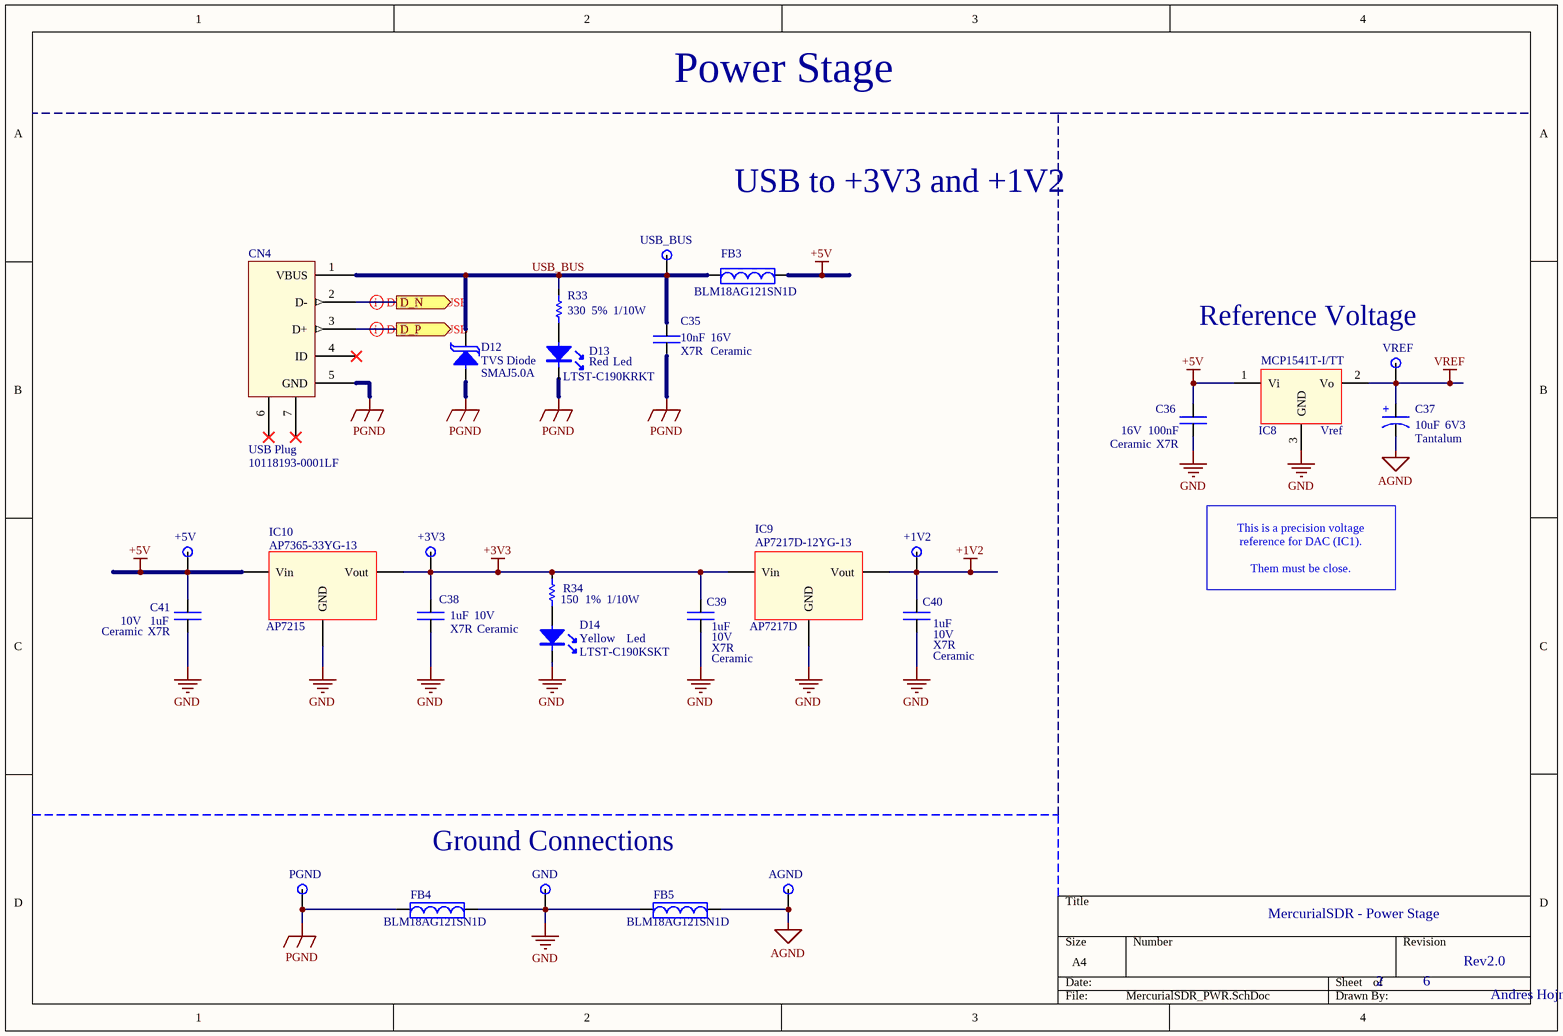
[diagram p5: MercurialSDR_PWR.SchDoc]

### Parts
C35  value 10nF  Temp Coef: X7R  VR: 16V  Material: Ceramic  [CAP_0603]  (hidden comment: Capacitor)
C36  value 100nF  Temp Coef: X7R  VR: 16V  Material: Ceramic  [CAP_0603]  (hidden comment: Capacitor)
C37  value 10uF  VR: 6V3  Material: Tantalum  [CAP_TANT_1206]  (hidden comment: Capacitor Polarizado)
C38  value 1uF  Temp Coef: X7R  VR: 10V  Material: Ceramic  [CAP_0603]  (hidden comment: Capacitor)
C39  value 1uF  Temp Coef: X7R  VR: 10V  Material: Ceramic  [CAP_0603]  (hidden comment: Capacitor)
C40  value 1uF  Temp Coef: X7R  VR: 10V  Material: Ceramic  [CAP_0603]  (hidden comment: Capacitor)
C41  value 1uF  Temp Coef: X7R  VR: 10V  Material: Ceramic  [CAP_0603]  (hidden comment: Capacitor)
CN4  USB Plug  Part Number: 10118193-0001LF  [USB_Micro]
D12  TVS Diode  Part Number: SMAJ5.0A  [DO-214AC]
D13  Led  Color: Red  Part Number: LTST-C190KRKT  [LED_0603]
D14  Led  Color: Yellow  Part Number: LTST-C190KSKT  [LED_0603]
FB3  Part Number: BLM18AG121SN1D  [FERRITE_BEAD_0603]  (hidden comment: Ferrite Bead)
FB4  Part Number: BLM18AG121SN1D  [FERRITE_BEAD_0603]  (hidden comment: Ferrite Bead)
FB5  Part Number: BLM18AG121SN1D  [FERRITE_BEAD_0603]  (hidden comment: Ferrite Bead)
IC8  Vref  Part Number: MCP1541T-I/TT  [SOT-23-3]
IC9  AP7217D  Part Number: AP7217D-12YG-13  [SOT89-3L]
IC10  AP7215  Part Number: AP7365-33YG-13  [SOT89-3L]
R33  value 330  Power: 1/10W  Tolerance: 5%  [RES_0603]  (hidden comment: Resistor SMD)
R34  value 150  Power: 1/10W  Tolerance: 1%  [RES_0603]  (hidden comment: Resistor SMD)
TP9  TP Name: USB_BUS  [TP_TOP]  (hidden comment: Test Point)
TP10  TP Name: VREF  [TP_TOP]  (hidden comment: Test Point)
TP11  TP Name: +5V  [TP_TOP]  (hidden comment: Test Point)
TP12  TP Name: +3V3  [TP_TOP]  (hidden comment: Test Point)
TP13  TP Name: +1V2  [TP_TOP]  (hidden comment: Test Point)
TP14  TP Name: PGND  [TP_TH]  (hidden comment: Test Point)
TP15  TP Name: GND  [TP_TOP]  (hidden comment: Test Point)
TP16  TP Name: AGND  [TP_TOP]  (hidden comment: Test Point)

### Ports
D_N (out), D_P (out)

### Nets
+1V2: C40.1 IC9.3(Vout) TP13.1(TP?)
+3V3: C38.1 C39.1 IC9.2(Vin) IC10.1(Vout) R34.1 TP12.1(TP?)
+5V: C36.1 C41.1 FB3.2 IC8.1(Vi) IC10.3(Vin) TP11.1(TP?)
AGND: C37.2 FB5.2 TP16.1(TP?)
GND: C36.2 C38.2 C39.2 C40.2 C41.2 D14.2(K) FB4.2 FB5.1 IC8.3(GND) IC9.1(GND) IC10.2(GND) TP15.1(TP?)
PGND: C35.2 CN4.5(GND) D12.1(A) D13.2(K) FB4.1 TP14.1(TP?)
VREF: C37.1 IC8.2(Vo) TP10.1(TP?)
USB_BUS: C35.1 CN4.1(VBUS) D12.2(K) FB3.1 R33.1 TP9.1(TP?)
USB_D_N: CN4.2(D-) ; port D_N
USB_D_P: CN4.3(D+) ; port D_P
NetD13_1: D13.1(A) R33.2
NetD14_1: D14.1(A) R34.2

Not connected (* = marked no-connect by the designer): CN4 4(ID)* 6(Shield)* 7(Shield)*

### Layout directives
differential pair: USB_D_N, USB_D_P

### Notes on the sheet
- Power Stage
- USB to +3V3 and +1V2
- (near TP10) Reference Voltage
- This is a precision voltage
  reference for DAC (IC1).
  Them must be close.
- (near TP15) Ground Connections
- (in symbol Cap Pol) +

### Library data of the parts
C35 = Cap: Capacitor no polarizado; Part Number: CC0603KRX7R7BB103
C36 = Cap: as C1 on sheet MercurialSDR_FPGA_BNK
C37 = Cap Pol: Part Number: TAJA106K006RNJ; Temp Coef: *
C38-C41 = Cap: Capacitor no polarizado; Part Number: CL10B105KP8NNNC
D12 = TVS_DIODE: TVS (Supresor de transitorios); Vr: 5V; Vrb: 6.4V; Vc: 9.2V
FB3 = Ferrite Bead: In: 800mA
IC8 = MCP1541: Reference Voltage; Reference Voltage: 4.096V
IC9 = AP7217D: Linear Voltage Regulator 1V2
IC10 = AP7215: Linear Voltage Regulator 3v3
R33 = Res: Resistor; Part Number: CR0603-JW-331ELF
R34 = Res: Resistor; Part Number: CR0603-FX-1500ELF
FB4 FB5 = Ferrite Bead: In: *

## Nets that join several sheets
+1V2: MercurialSDR_FPGA_P&P (11 pins), MercurialSDR_PWR (C40.1 IC9.3 TP13.1)
+3V3: MercurialSDR_MISC (10 pins), MercurialSDR_FPGA_BNK (C42.2 IC11.5), MercurialSDR_FPGA_P&P (26 pins), MercurialSDR_FTDI (15 pins), MercurialSDR_PWR (6 pins)
+5V: MercurialSDR_MISC (5 pins), MercurialSDR_FPGA_BNK (C1.1 C2.1 IC1.2 IC2.5), MercurialSDR_PWR (6 pins)
AGND: MercurialSDR_FPGA_BNK (5 pins), MercurialSDR_PWR (C37.2 FB5.2 TP16.1)
GND: MercurialSDR_MISC (22 pins), MercurialSDR_FPGA_BNK (6 pins), MercurialSDR_FPGA_P&P (23 pins), MercurialSDR_FTDI (26 pins), MercurialSDR_PWR (12 pins)
VREF: MercurialSDR_FPGA_BNK (IC1.3), MercurialSDR_PWR (C37.1 IC8.2 TP10.1)
CDONE_S: MercurialSDR_FPGA_P&P (D9.1 R3.2 U1.65), MercurialSDR_FTDI (IC4.23)
CS_S: MercurialSDR_FPGA_P&P (JP2.2 U1.71), MercurialSDR_FTDI (IC4.21)
MISO_S: MercurialSDR_FPGA_P&P (IC3.2 JP1.2), MercurialSDR_FTDI (IC4.18)
MOSI_S: MercurialSDR_FPGA_P&P (IC3.5 JP1.3), MercurialSDR_FTDI (IC4.17)
NetC31_2: MercurialSDR_MISC (C31.2 R19.2 SW0.4), MercurialSDR_FPGA_BNK (U1.110)
NetC32_2: MercurialSDR_MISC (C32.2 R26.2 SW1.4), MercurialSDR_FPGA_BNK (U1.115)
NetC33_2: MercurialSDR_MISC (C33.2 R29.2 SW2.4), MercurialSDR_FPGA_BNK (U1.139)
NetC34_2: MercurialSDR_MISC (C34.2 R32.2 SW3.4), MercurialSDR_FPGA_BNK (U1.144)
NetCN3_5: MercurialSDR_MISC (CN3.5), MercurialSDR_FPGA_BNK (U1.7)
NetCN3_6: MercurialSDR_MISC (CN3.6), MercurialSDR_FPGA_BNK (U1.8)
NetCN3_7: MercurialSDR_MISC (CN3.7), MercurialSDR_FPGA_BNK (U1.9)
NetCN3_8: MercurialSDR_MISC (CN3.8), MercurialSDR_FPGA_BNK (U1.10)
NetCN3_9: MercurialSDR_MISC (CN3.9), MercurialSDR_FPGA_BNK (U1.11)
NetCN3_10: MercurialSDR_MISC (CN3.10), MercurialSDR_FPGA_BNK (U1.12)
NetCN3_11: MercurialSDR_MISC (CN3.11), MercurialSDR_FPGA_BNK (U1.15)
NetCN3_12: MercurialSDR_MISC (CN3.12), MercurialSDR_FPGA_BNK (U1.16)
NetCN3_13: MercurialSDR_MISC (CN3.13), MercurialSDR_FPGA_BNK (U1.17)
NetCN3_14: MercurialSDR_MISC (CN3.14), MercurialSDR_FPGA_BNK (U1.18)
NetCN3_15: MercurialSDR_MISC (CN3.15), MercurialSDR_FPGA_BNK (U1.23)
NetCN3_16: MercurialSDR_MISC (CN3.16), MercurialSDR_FPGA_BNK (U1.24)
NetCN3_17: MercurialSDR_MISC (CN3.17), MercurialSDR_FPGA_BNK (U1.25)
NetCN3_18: MercurialSDR_MISC (CN3.18), MercurialSDR_FPGA_BNK (U1.26)
NetCN3_19: MercurialSDR_MISC (CN3.19), MercurialSDR_FPGA_BNK (U1.28)
NetCN3_20: MercurialSDR_MISC (CN3.20), MercurialSDR_FPGA_BNK (U1.29)
NetIC4_38: MercurialSDR_FPGA_BNK (U1.62), MercurialSDR_FTDI (IC4.38)
NetIC4_39: MercurialSDR_FPGA_BNK (U1.61), MercurialSDR_FTDI (IC4.39)
NetIC4_40: MercurialSDR_FPGA_BNK (U1.60), MercurialSDR_FTDI (IC4.40)
NetIC4_41: MercurialSDR_FPGA_BNK (U1.56), MercurialSDR_FTDI (IC4.41)
NetIC4_43: MercurialSDR_FPGA_BNK (U1.55), MercurialSDR_FTDI (IC4.43)
NetIC4_44: MercurialSDR_FPGA_BNK (U1.48), MercurialSDR_FTDI (IC4.44)
NetIC4_45: MercurialSDR_FPGA_BNK (U1.47), MercurialSDR_FTDI (IC4.45)
NetIC4_46: MercurialSDR_FPGA_BNK (U1.45), MercurialSDR_FTDI (IC4.46)
NetIC4_48: MercurialSDR_FPGA_BNK (U1.43), MercurialSDR_FTDI (IC4.48)
NetIC4_52: MercurialSDR_FPGA_BNK (U1.42), MercurialSDR_FTDI (IC4.52)
NetIC4_53: MercurialSDR_FPGA_BNK (U1.41), MercurialSDR_FTDI (IC4.53)
NetIC4_54: MercurialSDR_FPGA_BNK (U1.39), MercurialSDR_FTDI (IC4.54)
NetIC4_55: MercurialSDR_FPGA_BNK (U1.38), MercurialSDR_FTDI (IC4.55)
NetR18_2: MercurialSDR_MISC (R18.2), MercurialSDR_FPGA_BNK (U1.121)
NetR20_2: MercurialSDR_MISC (R20.2), MercurialSDR_FPGA_BNK (U1.122)
NetR21_2: MercurialSDR_MISC (R21.2), MercurialSDR_FPGA_BNK (U1.32)
NetR22_2: MercurialSDR_MISC (R22.2), MercurialSDR_FPGA_BNK (U1.33)
NetR23_1: MercurialSDR_MISC (R23.1), MercurialSDR_FPGA_BNK (U1.34)
NetR24_2: MercurialSDR_MISC (R24.2), MercurialSDR_FPGA_BNK (U1.124)
NetR25_2: MercurialSDR_MISC (R25.2), MercurialSDR_FPGA_BNK (U1.125)
NetR27_2: MercurialSDR_MISC (R27.2), MercurialSDR_FPGA_BNK (U1.130)
NetR28_2: MercurialSDR_MISC (R28.2), MercurialSDR_FPGA_BNK (U1.134)
NetR30_2: MercurialSDR_MISC (R30.2), MercurialSDR_FPGA_BNK (U1.135)
NetR31_2: MercurialSDR_MISC (R31.2), MercurialSDR_FPGA_BNK (U1.136)
RESET_S: MercurialSDR_FPGA_P&P (D8.2), MercurialSDR_FTDI (IC4.24)
SCK_S: MercurialSDR_FPGA_P&P (IC3.6 R1.2 U1.70), MercurialSDR_FTDI (IC4.16)
USB_D_N: MercurialSDR_FTDI (IC4.7), MercurialSDR_PWR (CN4.2)
USB_D_P: MercurialSDR_FTDI (IC4.8), MercurialSDR_PWR (CN4.3)